# Altium schematic sheet BMS Slave Device R1.5.SchDoc
size A4
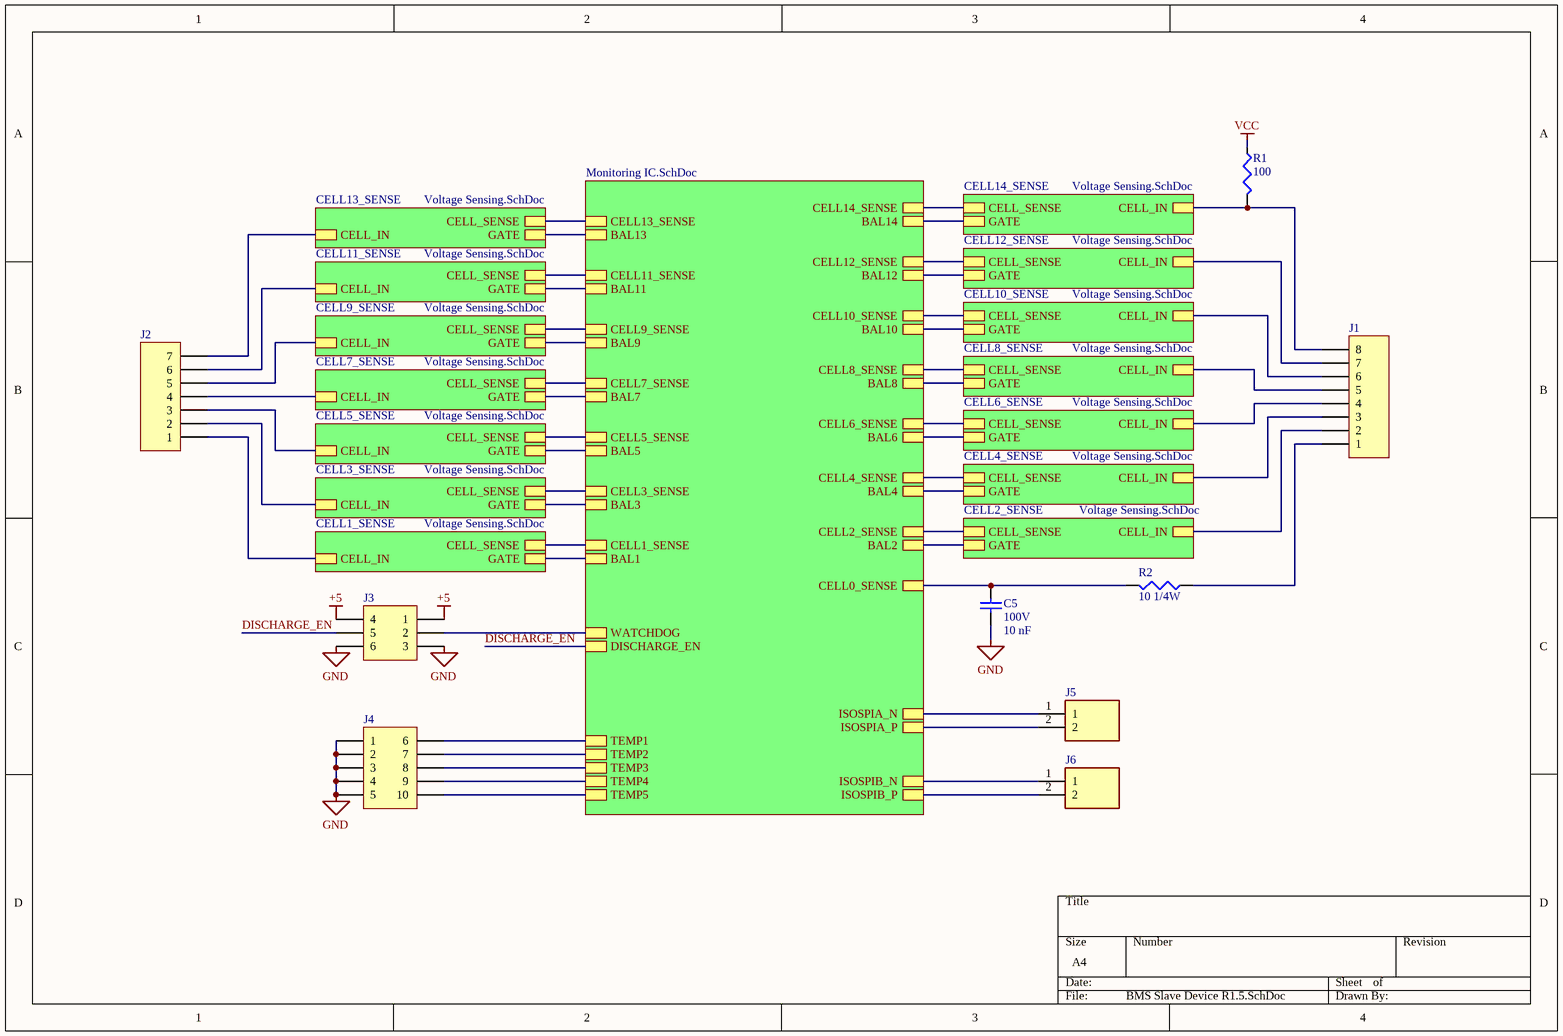
[diagram p0: BMS Slave Device R1.5.SchDoc]

## Parts
C5  100V  value 10 nF  [6-0805_N]
J1  Header 8  [HDR1X8]  (value not drawn)
J2  ODD CELLS  [HDR1X7]  (value not drawn)
J3  (no value)  [HDR2X3_CEN]
J4  THERMISTORS  [HDR2X5_CEN]  (value not drawn)
J5  B2B-XH-2__LF__SN_  [B2BXH2LFSN]  (value not drawn)
J6  B2B-XH-2__LF__SN_  [B2BXH2LFSN]  (value not drawn)
R1  value 100  [J1-0603]  (hidden comment: Res3)
R2  value 10 1/4W  [C1206]

## Sub-sheets
CELL1_SENSE = Voltage Sensing.SchDoc: CELL_SENSE, CELL_IN, GATE
CELL2_SENSE = Voltage Sensing.SchDoc: CELL_SENSE, CELL_IN, GATE
CELL3_SENSE = Voltage Sensing.SchDoc: CELL_SENSE, CELL_IN, GATE
CELL4_SENSE = Voltage Sensing.SchDoc: CELL_SENSE, CELL_IN, GATE
CELL5_SENSE = Voltage Sensing.SchDoc: CELL_SENSE, CELL_IN, GATE
CELL6_SENSE = Voltage Sensing.SchDoc: CELL_SENSE, CELL_IN, GATE
CELL7_SENSE = Voltage Sensing.SchDoc: CELL_SENSE, CELL_IN, GATE
CELL8_SENSE = Voltage Sensing.SchDoc: CELL_SENSE, CELL_IN, GATE
CELL9_SENSE = Voltage Sensing.SchDoc: CELL_SENSE, CELL_IN, GATE
CELL10_SENSE = Voltage Sensing.SchDoc: CELL_SENSE, CELL_IN, GATE
CELL11_SENSE = Voltage Sensing.SchDoc: CELL_SENSE, CELL_IN, GATE
CELL12_SENSE = Voltage Sensing.SchDoc: CELL_SENSE, CELL_IN, GATE
CELL13_SENSE = Voltage Sensing.SchDoc: CELL_SENSE, CELL_IN, GATE
CELL14_SENSE = Voltage Sensing.SchDoc: CELL_SENSE, CELL_IN, GATE
Designator = Monitoring IC.SchDoc: CELL14_SENSE, BAL14, CELL13_SENSE, BAL13, CELL12_SENSE, BAL12, CELL11_SENSE, BAL11, CELL10_SENSE, BAL10, CELL9_SENSE, BAL9, CELL8_SENSE, BAL8, CELL7_SENSE, BAL7, CELL6_SENSE, BAL6, CELL5_SENSE, BAL5, CELL4_SENSE, BAL4, CELL3_SENSE, BAL3, BAL2, CELL2_SENSE, CELL1_SENSE, BAL1, TEMP3, TEMP4, TEMP2, TEMP1, TEMP5, CELL0_SENSE, WATCHDOG, DISCHARGE_EN, ISOSPIA_N, ISOSPIB_P, ISOSPIB_N, ISOSPIA_P

## Nets
+5: J3.1 J3.4
GND: C5.1 J3.3 J3.6 J4.1 J4.2 J4.3 J4.4 J4.5
VCC: R1.2
DISCHARGE_EN: J3.5 ; sheet Designator/DISCHARGE_EN
NetC5_2: C5.2 R2.1 ; sheet Designator/CELL0_SENSE
NetJ1_1: J1.1 R2.2
NetJ1_2: J1.2 ; sheet CELL2_SENSE/CELL_IN
NetJ1_3: J1.3 ; sheet CELL4_SENSE/CELL_IN
NetJ1_4: J1.4 ; sheet CELL6_SENSE/CELL_IN
NetJ1_5: J1.5 ; sheet CELL8_SENSE/CELL_IN
NetJ1_6: J1.6 ; sheet CELL10_SENSE/CELL_IN
NetJ1_7: J1.7 ; sheet CELL12_SENSE/CELL_IN
NetJ1_8: J1.8 R1.1 ; sheet CELL14_SENSE/CELL_IN
NetJ2_1: J2.1 ; sheet CELL1_SENSE/CELL_IN
NetJ2_2: J2.2 ; sheet CELL3_SENSE/CELL_IN
NetJ2_3: J2.3 ; sheet CELL5_SENSE/CELL_IN
NetJ2_4: J2.4 ; sheet CELL7_SENSE/CELL_IN
NetJ2_5: J2.5 ; sheet CELL9_SENSE/CELL_IN
NetJ2_6: J2.6 ; sheet CELL11_SENSE/CELL_IN
NetJ2_7: J2.7 ; sheet CELL13_SENSE/CELL_IN
NetJ3_2: J3.2 ; sheet Designator/WATCHDOG
NetJ4_6: J4.6 ; sheet Designator/TEMP1
NetJ4_7: J4.7 ; sheet Designator/TEMP2
NetJ4_8: J4.8 ; sheet Designator/TEMP3
NetJ4_9: J4.9 ; sheet Designator/TEMP4
NetJ4_10: J4.10 ; sheet Designator/TEMP5
NetJ5_1: J5.1 ; sheet Designator/ISOSPIA_N
NetJ5_2: J5.2 ; sheet Designator/ISOSPIA_P
NetJ6_1: J6.1 ; sheet Designator/ISOSPIB_N
NetJ6_2: J6.2 ; sheet Designator/ISOSPIB_P
(unnamed): sheet Designator/CELL14_SENSE, sheet CELL14_SENSE/CELL_SENSE
(unnamed): sheet Designator/BAL14, sheet CELL14_SENSE/GATE
(unnamed): sheet Designator/CELL13_SENSE, sheet CELL13_SENSE/CELL_SENSE
(unnamed): sheet Designator/BAL13, sheet CELL13_SENSE/GATE
(unnamed): sheet Designator/CELL12_SENSE, sheet CELL12_SENSE/CELL_SENSE
(unnamed): sheet Designator/BAL12, sheet CELL12_SENSE/GATE
(unnamed): sheet Designator/CELL11_SENSE, sheet CELL11_SENSE/CELL_SENSE
(unnamed): sheet Designator/BAL11, sheet CELL11_SENSE/GATE
(unnamed): sheet Designator/CELL10_SENSE, sheet CELL10_SENSE/CELL_SENSE
(unnamed): sheet Designator/BAL10, sheet CELL10_SENSE/GATE
(unnamed): sheet Designator/CELL9_SENSE, sheet CELL9_SENSE/CELL_SENSE
(unnamed): sheet Designator/BAL9, sheet CELL9_SENSE/GATE
(unnamed): sheet Designator/CELL8_SENSE, sheet CELL8_SENSE/CELL_SENSE
(unnamed): sheet Designator/BAL8, sheet CELL8_SENSE/GATE
(unnamed): sheet Designator/CELL7_SENSE, sheet CELL7_SENSE/CELL_SENSE
(unnamed): sheet Designator/BAL7, sheet CELL7_SENSE/GATE
(unnamed): sheet Designator/CELL6_SENSE, sheet CELL6_SENSE/CELL_SENSE
(unnamed): sheet Designator/BAL6, sheet CELL6_SENSE/GATE
(unnamed): sheet Designator/CELL5_SENSE, sheet CELL5_SENSE/CELL_SENSE
(unnamed): sheet Designator/BAL5, sheet CELL5_SENSE/GATE
(unnamed): sheet Designator/CELL4_SENSE, sheet CELL4_SENSE/CELL_SENSE
(unnamed): sheet Designator/BAL4, sheet CELL4_SENSE/GATE
(unnamed): sheet Designator/CELL3_SENSE, sheet CELL3_SENSE/CELL_SENSE
(unnamed): sheet Designator/BAL3, sheet CELL3_SENSE/GATE
(unnamed): sheet Designator/BAL2, sheet CELL2_SENSE/GATE
(unnamed): sheet Designator/CELL2_SENSE, sheet CELL2_SENSE/CELL_SENSE
(unnamed): sheet Designator/CELL1_SENSE, sheet CELL1_SENSE/CELL_SENSE
(unnamed): sheet Designator/BAL1, sheet CELL1_SENSE/GATE

## Library data of the parts
C5 = Cap: Capacitor; Published: 8-Jun-2000; LatestRevisionDate: 17-Jul-2002; LatestRevisionNote: Re-released for DXP Platform.; PackageReference: RAD-0.3; Publisher: Altium Limited; PackageDescription: Radial Cap, Thru-Hole; 2 Leads; 0.3 in Pin Spacing
J1 = Header 8: Header, 8-Pin; LatestRevisionDate: 17-Jul-2002; LatestRevisionNote: Re-released for DXP Platform.; Publisher: Altium Limited
J2 = Header 7: LatestRevisionDate: 17-Jul-2002; LatestRevisionNote: Re-released for DXP Platform.; Publisher: Altium Limited
J3 = Header 3X2A: Header, 3-Pin, Dual row; LatestRevisionDate: 17-Jul-2002; LatestRevisionNote: Re-released for DXP Platform.; Publisher: Altium Limited
J4 = Header 5X2A: Header, 5-Pin, Dual row; LatestRevisionDate: 17-Jul-2002; LatestRevisionNote: Re-released for DXP Platform.; Publisher: Altium Limited
J5 J6 = B2B-XH-2__LF__SN_: Connector; Manufacturer_Name: JST (JAPAN SOLDERLESS TERMINALS); Manufacturer_Part_Number: B2B-XH-2 (LF)(SN); Datasheet Link: http://uk.rs-online.com/web/p/products/1755297; Height: 7mm; RS Part Number: 1755499; RS Price/Stock: http://uk.rs-online.com/web/p/products/1755499
R1 R2 = Res3: Resistor; Published: 8-Jun-2000; LatestRevisionDate: 29-May-2009; LatestRevisionNote: IPC-7351 Footprint Added.; PackageReference: J1-0603; Publisher: Altium Limited; PackageDescription: Chip Resistor